# EAGLE design UPS (EAGLE 9.6.2)
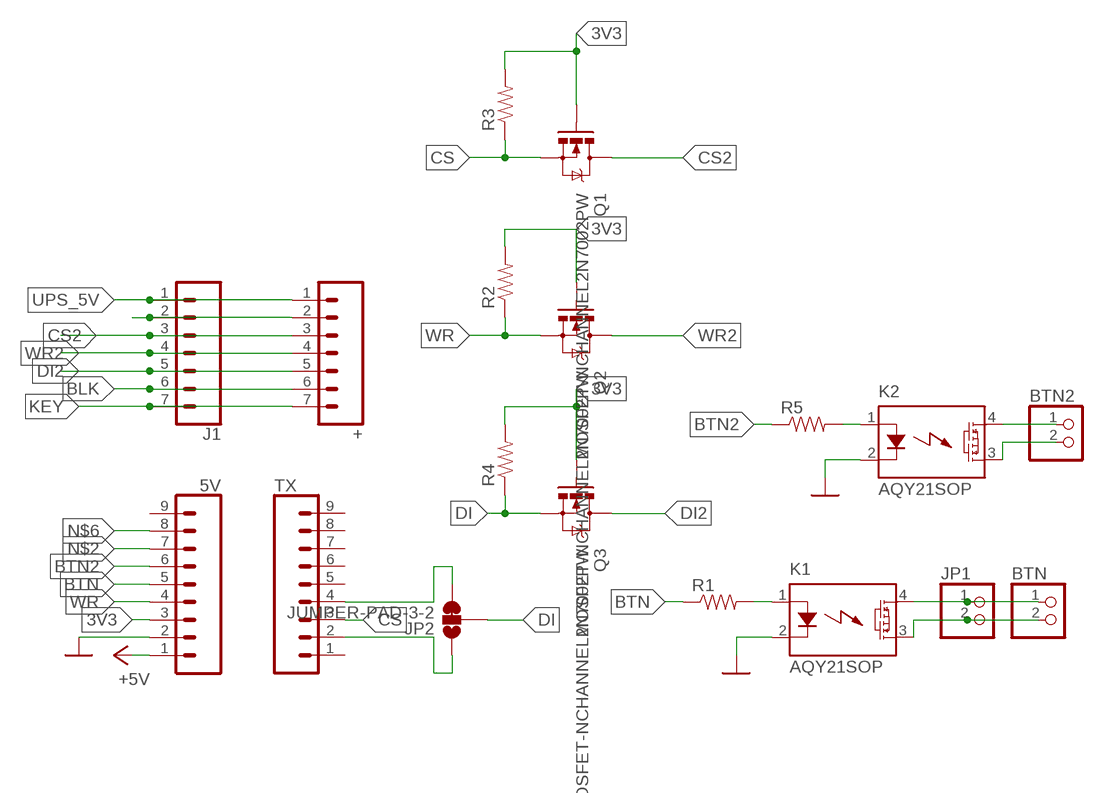
[diagram p0: schematic, sheet 1]

## Parts
5V  CONN_09  [1X09]
+  CONN_07  [1X07]
BTN  PINHD-1X2  [1X02]
BTN2  PINHD-1X2  [1X02]
J1  CONN_07  [1X07]
JP1  PINHD-1X2  [1X02]
JP2  JUMPER-PAD-3-2  JUMPER-PAD-3-2OF3_NC_BY_TRACE_SMALL  [PAD-JUMPER-3-2OF3_NC_BY_TRACE_YES_SILK_FULL_BOX]
K1  AQY21SOP  [SOP04]
K2  AQY21SOP  [SOP04]
Q1  MOSFET-NCHANNEL2N7002PW  [SOT323]
Q2  MOSFET-NCHANNEL2N7002PW  [SOT323]
Q3  MOSFET-NCHANNEL2N7002PW  [SOT323]
R1  RESISTOR0805-RES  [0805]
R2  RESISTOR0805-RES  [0805]
R3  RESISTOR0805-RES  [0805]
R4  RESISTOR0805-RES  [0805]
R5  RESISTOR0805-RES  [0805]
TX  CONN_09  [1X09]

## Nets
3V3: 5V.3 Q1.1(G) Q2.1(G) Q3.1(G) R2.2 R3.2 R4.2
+5V: 5V.1
BLK: +.6 J1.6
BTN: 5V.5 R1.1
BTN2: 5V.6 R5.1
CS: Q1.2(S) R3.1 TX.3
CS2: +.3 J1.3 Q1.3(D)
DI: JP2.2 Q3.2(S) R4.1
DI2: +.5 J1.5 Q3.3(D)
GND: 5V.2 K1.2(K) K2.2(K)
KEY: +.7 J1.7
N$2: 5V.7
N$3: BTN.1 JP1.1 K1.4(DS1)
N$4: BTN.2 JP1.2 K1.3(DS2)
N$5: K1.1(A) R1.2
N$6: 5V.8
N$7: JP2.3 TX.4
N$8: JP2.1 TX.2
N$9: BTN2.1 K2.4(DS1)
N$10: BTN2.2 K2.3(DS2)
N$11: K2.1(A) R5.2
UPS_5V: +.1 J1.1
UPSGND: +.2 J1.2
WR: 5V.4 Q2.2(S) R2.1
WR2: +.4 J1.4 Q2.3(D)
Unconnected: 5V.9 TX.1 TX.5 TX.6 TX.7 TX.8 TX.9

## Library data of the parts
5V TX = SparkFun-Connectors:CONN_09: Multi connection point. Often used as Generic Header-pin footprint for 0.1 inch spaced/style header connections On any of the 0.1 inch spaced packages, you can populate with these: Break Away Headers - Straight <https://www.sparkfun.com/products/116> (PRT-00116) Break Away Male Headers - Right Angle <https://www.sparkfun.com/products/553> (PRT-00553) Female Headers <https://www.sparkfun.com/products/115> (PRT-00115) Break Away Headers - Machine Pin <https://www.sparkfun.com/products/117> (PRT-00117) Break Away Female Headers - Swiss Machine Pin <https://www.sparkfun.com/products/743> (PRT-00743) For SCREWTERMINALS and SPRING TERMINALS visit here: Screw Terimnals on SparkFun.com <https://www.sparkfun.com/search/results?term=Screw+Terminals> (5mm/3.5mm/2.54mm spacing) This device is also useful as a general connection point to wire up your design to another part of your project. Our various solder wires solder well into these plated through hole pads. Hook-Up Wire - Assortment (Stranded, 22 AWG) <https://www.sparkfun.com/products/11375> (PRT-11375) Hook-Up Wire - Assortment (Solid Core, 22 AWG) <https://www.sparkfun.com/products/11367> (PRT-11367) View the entire wire category on our website here <https://www.sparkfun.com/categories/141> Special notes: Molex polarized connector foot print use with SKU : PRT-08231 with associated crimp pins and housings. 1MM SMD Version SKU: PRT-10208 NOTES ON THE VARIANTS LOCK and LOCK_LONGPADS... This footprint was designed to help hold the alignment of a through-hole component (i.e. 6-pin header) while soldering it into place. You may notice that each hole has been shifted either up or down by 0.005 of an inch from it's more standard position (which is a perfectly straight line). This slight alteration caused the pins (the squares in the middle) to touch the edges of the holes. Because they are alternating, it causes a "brace" to hold the component in place. 0.005 has proven to be the perfect amount of "off-center" position when using our standard breakaway headers. Although looks a little odd when you look at the bare footprint, once you have a header in there, the alteration is very hard to notice. Also,if you push a header all the way into place, it is covered up entirely on the bottom side.
+ J1 = SparkFun-Connectors:CONN_07: Multi connection point. Often used as Generic Header-pin footprint for 0.1 inch spaced/style header connections On any of the 0.1 inch spaced packages, you can populate with these: Break Away Headers - Straight <https://www.sparkfun.com/products/116> (PRT-00116) Break Away Male Headers - Right Angle <https://www.sparkfun.com/products/553> (PRT-00553) Female Headers <https://www.sparkfun.com/products/115> (PRT-00115) Break Away Headers - Machine Pin <https://www.sparkfun.com/products/117> (PRT-00117) Break Away Female Headers - Swiss Machine Pin <https://www.sparkfun.com/products/743> (PRT-00743) For SCREWTERMINALS and SPRING TERMINALS visit here: Screw Terimnals on SparkFun.com <https://www.sparkfun.com/search/results?term=Screw+Terminals> (5mm/3.5mm/2.54mm spacing) This device is also useful as a general connection point to wire up your design to another part of your project. Our various solder wires solder well into these plated through hole pads. Hook-Up Wire - Assortment (Stranded, 22 AWG) <https://www.sparkfun.com/products/11375> (PRT-11375) Hook-Up Wire - Assortment (Solid Core, 22 AWG) <https://www.sparkfun.com/products/11367> (PRT-11367) View the entire wire category on our website here <https://www.sparkfun.com/categories/141> Special notes: Molex polarized connector foot print use with SKU : PRT-08231 with associated crimp pins and housings. 1MM SMD Version SKU: PRT-10208 NOTES ON THE VARIANTS LOCK and LOCK_LONGPADS... This footprint was designed to help hold the alignment of a through-hole component (i.e. 6-pin header) while soldering it into place. You may notice that each hole has been shifted either up or down by 0.005 of an inch from it's more standard position (which is a perfectly straight line). This slight alteration caused the pins (the squares in the middle) to touch the edges of the holes. Because they are alternating, it causes a "brace" to hold the component in place. 0.005 has proven to be the perfect amount of "off-center" position when using our standard breakaway headers. Although looks a little odd when you look at the bare footprint, once you have a header in there, the alteration is very hard to notice. Also,if you push a header all the way into place, it is covered up entirely on the bottom side.
BTN BTN2 JP1 = pinhead:PINHD-1X2: PIN HEADER
JP2 = SP5C9F~1:JUMPER-PAD-3-2OF3_NC_BY_TRACE
K1 K2 = relay:AQY*: PhotoMOS Relay NAiS Source: http://www.panasonic-electric-works.com/catalogues/downloads/photomos/ds_x615_en_aqz10_20.pdf; OC_FARNELL: unknown; OC_NEWARK: unknown
Q1-Q3 = SparkFun-DiscreteSemi:MOSFET-NCHANNEL: Common NMOSFET Parts MFG P/N Store ID Prod ID FDD8780 TRANS-09984 SI7820DN TRANS-11055 FDS6630A IC-08089 2N7002PW TRANS-11151 FQP30N06L COM-10213 TRANS-10060 BSS123LT1G TRANS-08345 BSS138 TRANS-00830 BS170 2N7000; PROD_ID: TRANS-11151
R1-R5 = SparkFun-Resistors:RESISTOR: Resistor Basic schematic elements and footprints for 0603, 1206, and PTH resistors.

## Board
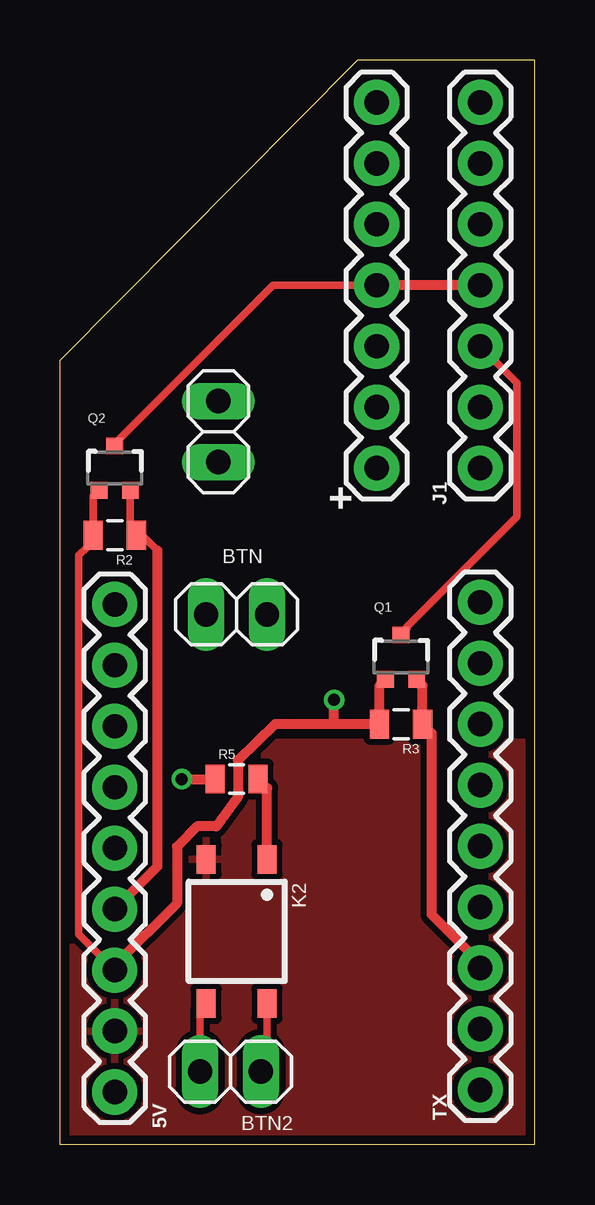
[diagram p1: board, top side]
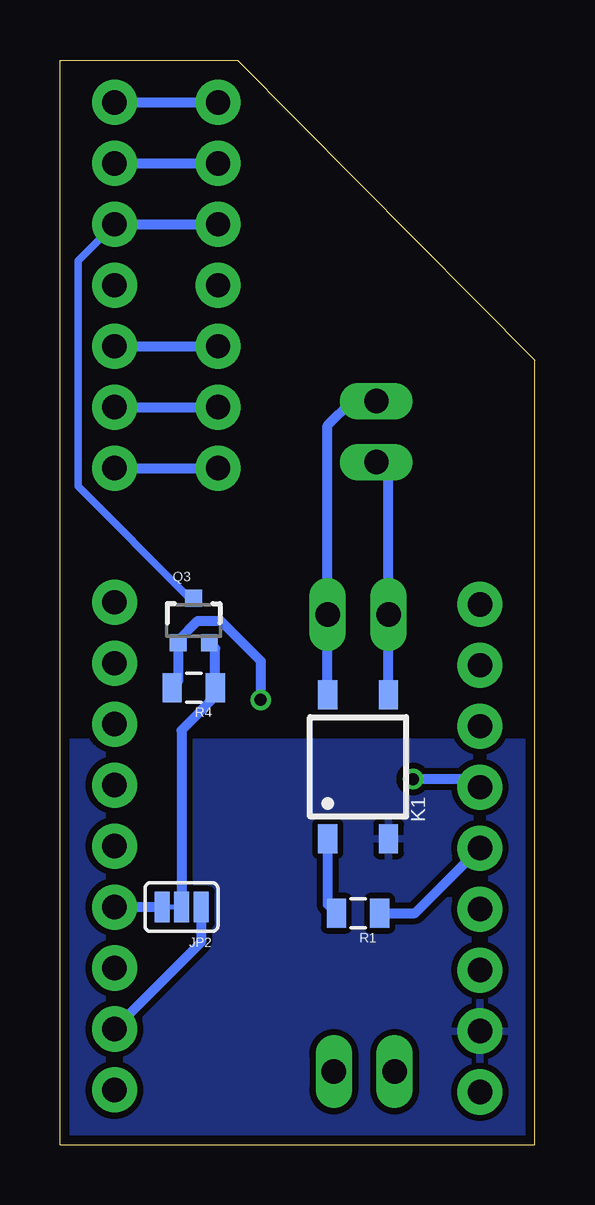
[diagram p2: board, bottom side, seen from below]

Size 19.8 x 45.2 mm. Coordinates in mm from the lower left corner, seen from the top.
Outline: 19.8,0 19.8,45.2 12.4,45.2 0,32.7 0,0 19.8,0
Copper layers (1*16): Top 0.0356mm / dielectric 1.5011mm / Bottom 0.0356mm
Design rules "LaenPCBOrder": minimum track width 6mil, minimum drill 13mil, track to track 6mil, track to pad 6mil, pad to pad 6mil, via to via 6mil, smd to smd 6mil, copper to edge 15mil, drill to drill 6mil, minimum pad ring 7mil, minimum via ring 7mil, stop-mask expansion 4mil, vias tented up to drill 0mil, thermal gap 10mil

### Footprints (pad centres in the part's own frame; a part is rotated, then mirrored left to right if it is on the bottom)
1X09 = drill 1.016 pad 1.88: 1 0,0; 2 2.54,0; 3 5.08,0; 4 7.62,0; 5 10.16,0; 6 12.7,0; 7 15.24,0; 8 17.78,0; 9 20.32,0
1X07 = drill 1.016 pad 1.88: 1 0,0; 2 2.54,0; 3 5.08,0; 4 7.62,0; 5 10.16,0; 6 12.7,0; 7 15.24,0
1X02 = drill 1.016 long: 1 -1.27,0; 2 1.27,0
PAD-JUMPER-3-2OF3_NC_BY_TRACE_YES_SILK_FULL_BOX = smd 0.635 x 1.27: 1 -0.813,0; 2 0,0; 3 0.813,0
SOP04 = smd 0.8 x 1.2: 1 -1.27,-3; 2 1.27,-3; 3 1.27,3; 4 -1.27,3
SOT323 = smd 0.7 x 0.7: 1 -0.65,-0.925; 2 0.65,-0.925; 3 0,0.925
0805 = smd 0.8 x 1.2: 1 -0.9,0; 2 0.9,0

### Placement (x,y rotation side)
5V  2.29,2.2 90 top
+  13.21,28.19 90 top
BTN  7.37,22.1 180 top
BTN2  7.11,3.05 180 top
J1  17.53,28.19 90 top
JP1  6.6,29.72 270 top
JP2  14.73,9.91 180 bottom
K1  7.37,15.75 0 bottom
K2  7.37,8.89 180 top
Q1  14.22,20.32 0 top
Q2  2.29,28.19 0 top
Q3  14.22,21.84 0 bottom
R1  7.37,9.65 180 bottom
R2  2.29,25.4 180 top
R3  14.22,17.53 180 top
R4  14.22,19.05 180 bottom
R5  7.37,15.24 0 top
TX  17.53,2.29 90 top

### Tracks (layer width: path | path; a pad name or v marks a point on that pad's centre or on a via)
3V3  (via drill 0.5)
  Top 0.305: Q2.1 1.39,27.02 R2.2 1.13,25.15 1.13,24.9 0.79,24.56 0.79,8.78 5V.3
  Top 0.406: R3.2 13.32,19.14 Q1.1 | R3.2 8.98,17.53 7.42,16.03 7.42,14.49 6.52,13.27 5.72,13.27 4.88,12.43 4.88,10.07 2.29,7.48 5V.3 | R3.2 11.43,17.53 v11.43,18.54
  Bottom 0.305: R4.2 14.87,19.3
  Bottom 0.406: 14.87,19.3 Q3.1 14.87,21 14.05,21.83 13.1,21.83 11.43,20.16 v11.43,18.54
BLK
  Bottom 0.406: J1.6 13.6,40.89 13.27,40.57 13.27,40.83 +.6
BTN
  Bottom 0.406: R1.1 4.99,9.65 5V.5
BTN2  (via drill 0.5)
  Top 0.406: v5.08,15.24 R5.1
  Bottom 0.406: 5V.6 2.63,15.24 v5.08,15.24
CS
  Top 0.406: TX.3 17.53,7.57 15.49,9.6 15.49,17.16 R3.1 15.12,19.14 Q1.2
CS2
  Top 0.305: J1.3 19.05,31.75 19.05,26.16 14.48,21.59 14.48,21.5 Q1.3
  Bottom 0.406: J1.3 +.3
DI
  Bottom 0.305: 13.32,20.67 Q3.2
  Bottom 0.406: JP2.2 14.73,17.27 13.32,18.68 R4.1 13.32,20.67
DI2
  Bottom 0.305: J1.5 19.05,36.83 19.05,27.43 14.43,22.81 14.35,22.9 Q3.3
  Bottom 0.406: J1.5 +.5
GND
  pour Top (isolate 0.254): 0,16.76 19.81,16.76 19.81,0 0,0
  pour Bottom (isolate 0.254): 0,16.76 0,0 19.81,0 19.81,16.76
KEY
  Bottom 0.406: J1.7 13,43.43 13.1,43.33 +.7
N$3
  Bottom 0.406: K1.4 BTN.1 8.64,29.97 7.62,30.99 JP1.1
N$4
  Bottom 0.406: K1.3 BTN.2 6.1,27.94 JP1.2
N$5
  Bottom 0.406: K1.1 8.64,10.02 R1.2
N$7
  Bottom 0.406: JP2.3 TX.4
N$8
  Bottom 0.406: JP2.1 13.92,8.43 TX.2
N$9
  Top 0.305: K2.4 8.64,3.3 BTN2.1
N$10
  Top 0.305: BTN2.2 5.84,5.64 K2.3
N$11
  Top 0.305: 8.64,14.87 R5.2
  Top 0.406: K2.1 8.64,14.87
UPS_5V
  Bottom 0.406: J1.1 +.1
UPSGND
  Bottom 0.406: J1.2 +.2
WR
  Top 0.305: 4.06,24.75 3.42,25.4 3.3,25.4 | 3.3,25.4 R2.1 | Q2.2 2.94,25.77 3.3,25.4
  Top 0.406: 4.06,24.75 4.06,11.6 5V.4
WR2
  Top 0.305: J1.4 8.89,35.81 2.29,29.21 Q2.3
  Top 0.406: J1.4 +.4

### Text on the board
tStop: CuriousTech.net
bStop: CuriousTech.net